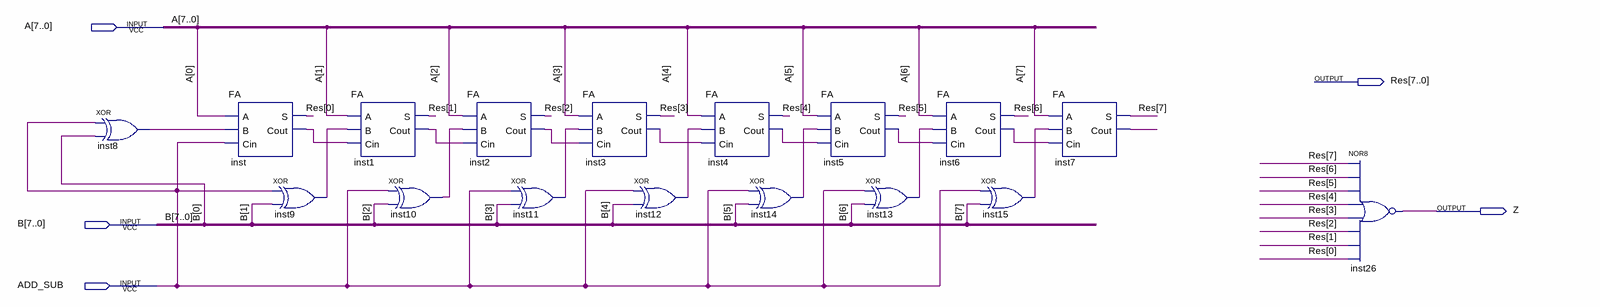
[diagram p0: schematic sheet]
// Quartus schematic ADDER_8Bits_ADDSUB.bdf as structural Verilog: 17 symbols, 5 pins
module ADDER_8Bits_ADDSUB (
  input  [7:0] A,
  input  [7:0] B,
  input  ADD_SUB,
  output [7:0] Res,
  output Z
);

  wire inst1_cout, inst2_cout, inst3_cout, inst4_cout, inst5_cout, inst6_cout, inst7_cout, inst8_out,
       inst9_out, inst10_out, inst11_out, inst12_out, inst13_out, inst14_out, inst15_out, inst_cout;

  xor inst8 (inst8_out, ADD_SUB, B[0]);
  FA inst (.A(A[0]), .B(inst8_out), .Cin(ADD_SUB), .S(Res[0]), .Cout(inst_cout));
  xor inst9 (inst9_out, ADD_SUB, B[1]);
  FA inst1 (.A(A[1]), .B(inst9_out), .Cin(inst_cout), .S(Res[1]), .Cout(inst1_cout));
  xor inst10 (inst10_out, ADD_SUB, B[2]);
  FA inst2 (.A(A[2]), .B(inst10_out), .Cin(inst1_cout), .S(Res[2]), .Cout(inst2_cout));
  xor inst11 (inst11_out, ADD_SUB, B[3]);
  FA inst3 (.A(A[3]), .B(inst11_out), .Cin(inst2_cout), .S(Res[3]), .Cout(inst3_cout));
  xor inst12 (inst12_out, ADD_SUB, B[4]);
  FA inst4 (.A(A[4]), .B(inst12_out), .Cin(inst3_cout), .S(Res[4]), .Cout(inst4_cout));
  xor inst14 (inst14_out, ADD_SUB, B[5]);
  FA inst5 (.A(A[5]), .B(inst14_out), .Cin(inst4_cout), .S(Res[5]), .Cout(inst5_cout));
  xor inst13 (inst13_out, ADD_SUB, B[6]);
  FA inst6 (.A(A[6]), .B(inst13_out), .Cin(inst5_cout), .S(Res[6]), .Cout(inst6_cout));
  xor inst15 (inst15_out, ADD_SUB, B[7]);
  FA inst7 (.A(A[7]), .B(inst15_out), .Cin(inst6_cout), .S(Res[7]), .Cout(inst7_cout));
  nor inst26 (Z, Res[7], Res[6], Res[5], Res[4], Res[3], Res[2], Res[1], Res[0]);
endmodule
